# Altium schematic sheet IO Management.SchDoc
size C
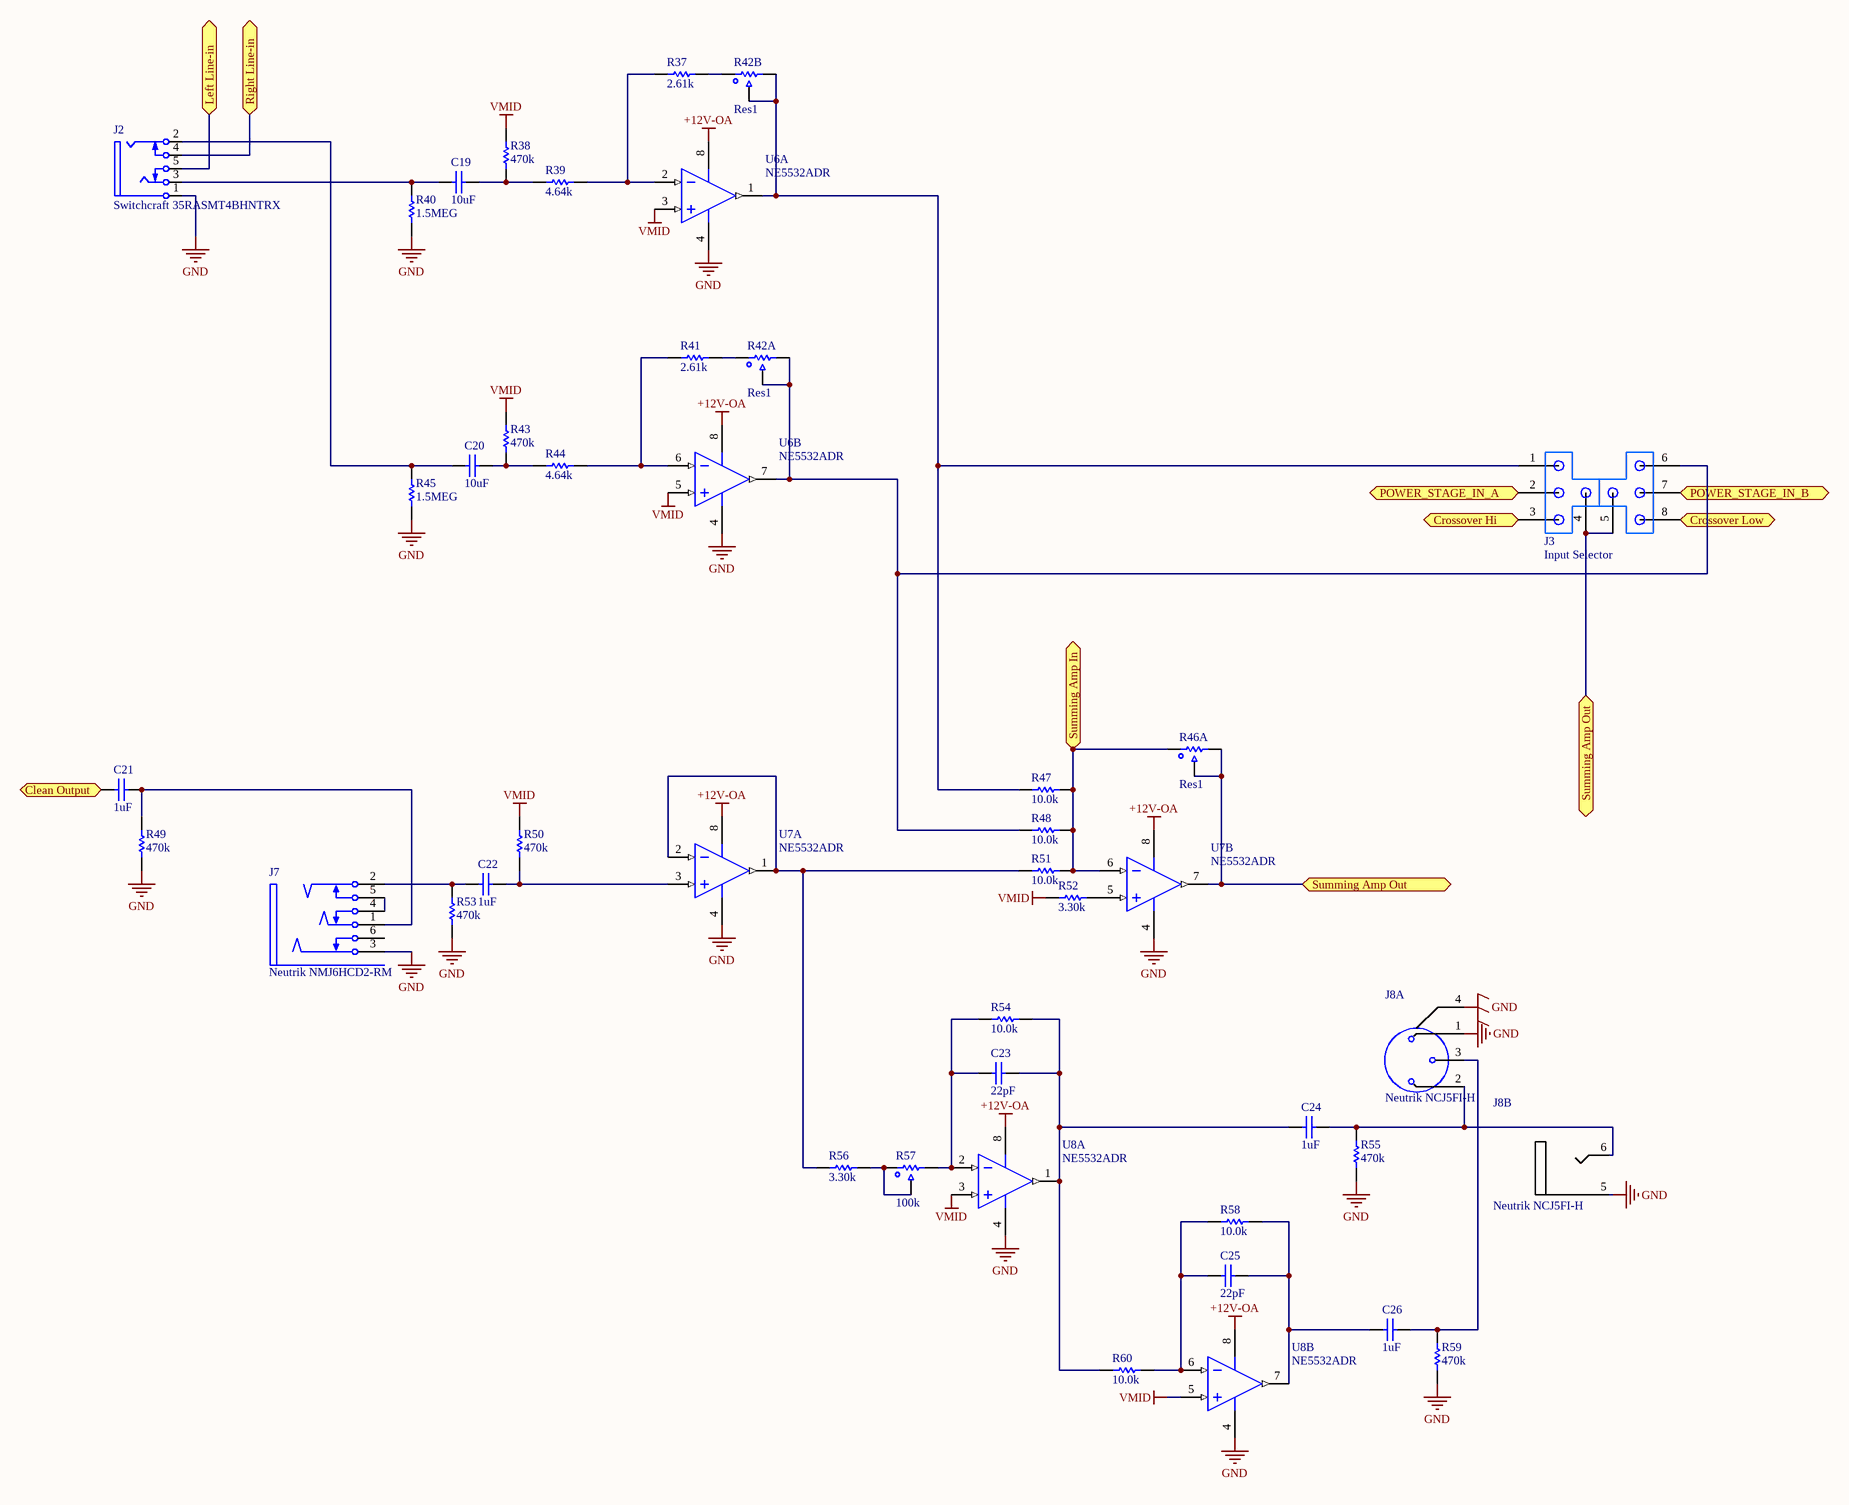
[diagram p0: IO Management.SchDoc]

## Parts
C19  10uF  [PCB-5c5sxu4lzqbcrp2k6kwf-1]
C20  10uF  [PCB-5c5sxu4lzqbcrp2k6kwf-1]
C21  1uF  [PCB-2wbb7ys4jm9z9dflo2i2-1]
C22  1uF  [PCB-2wbb7ys4jm9z9dflo2i2-1]
C23  22pF  [PCB-o7p1koxmr9wqz41gh50t-1]
C24  1uF  [PCB-2wbb7ys4jm9z9dflo2i2-1]
C25  22pF  [PCB-o7p1koxmr9wqz41gh50t-1]
C26  1uF  [PCB-2wbb7ys4jm9z9dflo2i2-1]
J2  Switchcraft 35RASMT4BHNTRX  [SWIT-35RASMT4BHNTRX_V]
J3  Input Selector  [PCB-r6lzv2511lj5epnn9hpr-1]
J7  Neutrik NMJ6HCD2-RM  [PCB-3345220-1]
J8  Neutrik NCJ5FI-H  [PCB-kqs2tegzu26oi3jl7i0a-1]  (parts A,B of 2)
R37  2.61k  [PCB-2fy4x9bysi6rpexrr8fu-1]
R38  470k  [RESC1609X55X28LL05T18]
R39  4.64k  [RESC1609X55X28LL05T18]
R40  1.5MEG  [RESC1608X55X30LL15T15]
R41  2.61k  [PCB-2fy4x9bysi6rpexrr8fu-1]
R42  Res1  [PCB-3c7eria7znpasna51pjn-1]  (parts A,B of 2)
R43  470k  [RESC1609X55X28LL05T18]
R44  4.64k  [RESC1609X55X28LL05T18]
R45  1.5MEG  [RESC1608X55X30LL15T15]
R46  Res1  [PCB-3c7eria7znpasna51pjn-1]  (part A of 2)
R47  10.0k  [RESC1609X55X28LL05T18]
R48  10.0k  [RESC1609X55X28LL05T18]
R49  470k  [RESC1609X55X28LL05T18]
R50  470k  [RESC1609X55X28LL05T18]
R51  10.0k  [RESC1609X55X28LL05T18]
R52  3.30k  [RESC1609X55X28LL05T18]
R53  470k  [RESC1609X55X28LL05T18]
R54  10.0k  [RESC1609X55X28LL05T18]
R55  470k  [RESC1609X55X28LL05T18]
R56  3.30k  [RESC1609X55X28LL05T18]
R57  100k  [PCB-3c7eria7znpasna51pjn-1]
R58  10.0k  [RESC1609X55X28LL05T18]
R59  470k  [RESC1609X55X28LL05T18]
R60  10.0k  [RESC1609X55X28LL05T18]
U6  NE5532ADR  [TI-D8_L]  (parts A,B of 2)
U7  NE5532ADR  [TI-D8_L]  (parts A,B of 2)
U8  NE5532ADR  [TI-D8_L]  (parts A,B of 2)

## Ports
Clean Output, Crossover Hi, Crossover Low, Left Line-in, POWER_STAGE_IN_A, POWER_STAGE_IN_B, Right Line-in, Summing Amp In, Summing Amp Out

## Nets
+12V-OA: U6.8(VCC+) U7.8(VCC+) U8.8(VCC+)
GND: J2.1 J7.3 J8.1 J8.4(G) J8.5(S) R40.1 R45.1 R49.1 R53.1 R55.1 R59.1 U6.4(VCC-) U7.4(VCC-) U8.4(VCC-)
VMID: R38.2 R43.2 R50.2 R52.1 U6.3(IN1+) U6.5(IN2+) U8.3(IN1+) U8.5(IN2+)
Clean Output: C21.1 ; port Clean Output
Crossover Hi: J3.3 ; port Crossover Hi
Crossover Low: J3.8 ; port Crossover Low
Left Line-in: J2.5 ; port Left Line-in
POWER_STAGE_IN_A: J3.2 ; port POWER_STAGE_IN_A
POWER_STAGE_IN_B: J3.7 ; port POWER_STAGE_IN_B
Right Line-in: J2.4 ; port Right Line-in
Summing Amp In: R46.R1_1 R47.2 R48.2 R51.2 U7.6(IN2-) ; port Summing Amp In
Summing Amp Out: J3.4 J3.5 R46.R1_2 R46.R1_3 U7.7(OUT2) ; port Summing Amp Out
NetC19_1: C19.1 J2.3 R40.2
NetC19_2: C19.2 R38.1 R39.1
NetC20_1: C20.1 J2.2 R45.2
NetC20_2: C20.2 R43.1 R44.1
NetC21_2: C21.2 J7.1 R49.2
NetC22_1: C22.1 J7.2 R53.2
NetC22_2: C22.2 R50.1 U7.3(IN1+)
NetC23_1: C23.1 R54.1 R57.3 U8.2(IN1-)
NetC23_2: C23.2 C24.1 R54.2 R60.1 U8.1(OUT1)
NetC24_2: C24.2 J8.2 J8.6(T) R55.2
NetC25_1: C25.1 R58.1 R60.2 U8.6(IN2-)
NetC25_2: C25.2 C26.1 R58.2 U8.7(OUT2)
NetC26_2: C26.2 J8.3 R59.2
NetJ3_1: J3.1 R42.R2_2 R42.R2_3 R47.1 U6.1(OUT1)
NetJ3_6: J3.6 R42.R1_2 R42.R1_3 R48.1 U6.7(OUT2)
NetJ7_4: J7.4 J7.5
NetR37_1: R37.1 R39.2 U6.2(IN1-)
NetR37_2: R37.2 R42.R2_1
NetR41_1: R41.1 R44.2 U6.6(IN2-)
NetR41_2: R41.2 R42.R1_1
NetR51_1: R51.1 R56.1 U7.1(OUT1) U7.2(IN1-)
NetR52_2: R52.2 U7.5(IN2+)
NetR56_2: R56.2 R57.1 R57.2

Not connected (* = marked no-connect by the designer): J7 6

## Library data of the parts
C19 C20 = CMP-f13b3967d5202efc-1: Cap Film 10uF 63V PET 5% (26.5 X 8.5 X 17mm) Radial Wound 22.5mm 105C Automotive Bulk; Manufacturer Part Number: 60DN51005030J; Manufacturer: Kemet; RoHS: Compliant; Capacitance: 10uF; OctopartID: f13b3967d5202efc
C21 C22 C24 C26 = CMP-85fe4cf7e9a75a39-2: B32529 Series 63 V 1 uF Radial LS=5 mm Stacked Metallized PET Film Capacitor; Manufacturer Part Number: B32529C105J289; Manufacturer: TDK; Capacitance: 1uF
C23 C25 = CMP-5839914dedd787fe-1: CL10 Series 22 pF 50V ±5 % Tolerance C0G SMT Multilayer Ceramic Capacitor; Manufacturer: Samsung; Manufacturer Part Number: CL10C220JB8NNNC; Dielectric Characteristic: C0G/NP0; Octopart URL: http://octopart.com/cl10c220jb8nnnc-samsung-8294536; Mounting Style: Surface Mount
J2 = CMP-329442-8: Female 3.5 mm Phone Jack, 5 Position, Height 5 mm, RoHS, Tape and Reel; Lead-Free Status: Lead Free; RoHS: Compliant; PackageDescription: Female 3.5 mm Phone Jack, 5 Position, Height 5 mm; OctopartID: 05ecccef17f4da2b; Seller Landing  Url: https://octopart-clicks.com/click/track?country=US&ak=8157f166&sig=00fbda3&sid=459&ppid=604030&vpid=40873333&ct=offers; Octopart Url: http://octopart.com/35rasmt4bhntrx-switchcraft-604030; PackageReference: 35RASMT4BHNTRX; Manufacturer Part Number: 35RASMT4BHNTRX; DatasheetVersion: Rev. C, 07/2014
J3 = CMP-fydh8mqcn19uwpn0klog-2: 3 way stereo H-shaped pin header jumper 2.54mm
J7 = CMP-3345220-6: Phone Connectors 1/4" STERO JCK SWTCH FULL TRD NSE PC HORZ; OctopartID: de6b171403b801ac; Manufacturer: Neutrik; Manufacturer Part Number: NMJ6HCD2-RM; Octopart Url: https://octopart.com/nmj6hcd2-rm-neutrik-7731381
J8 = CMP-d6ad1fac6a3f096a-1: Neutrik NCJ5FI-H Combo 3-Pin XLRF / 1/4 Inch Mono Horizontal PCB Mount; Gender: Female; Voltage Rating (DC): 50.0 V; Number of Positions: 5; Octopart URL: http://octopart.com/ncj5fi-h-neutrik-760308; OctopartID: d6ad1fac6a3f096a; Contact Plating: Gold; Mounting Style: Solder, PCB; RoHS: Compliant; Manufacturer Part Number: NCJ5FI-H; Manufacturer: Neutrik
R37 R41 = CMP-9c6957e4a20743ae-1: Res Thin Film 0603 2.61K Ohm 0.1% 1/10W ±25ppm/°C Molded SMD Paper T/R; Manufacturer: Vishay; Manufacturer Part Number: MCT06030D2611BP100; Resistance: 2.61 kΩ; Power Rating: 100 mW; Size-Length: 1.55 mm; Resistance Tolerance: ±0.1%; Packaging: Tape & Reel (TR)
R38 R43 R49 R50 R53 R55 R59 = CMP-f7e03fd772d42827-1: Res Thin Film 0603 470K Ohm 0.1% 1/10W ±25ppm/°C Molded SMD SMD Paper T/R; Manufacturer Part Number: MCT06030D4703BP100; Lead-Free Status: Lead Free
R39 R44 = CMP-ae07668bb89171c0-1: Res Thin Film 0603 4.64K Ohm 0.1% 1/10W ±25ppm/°C Molded SMD SMD Paper T/R; Manufacturer Part Number: MCT06030D4641BP100; Power Rating: 100 mW; Lead-Free Status: Lead Free; Size-Width: 850 µm; Size-Length: 1.55 mm; Packaging: Tape & Reel (TR); Case/Package: 0603; Mounting Style: Surface Mount; Octopart URL: http://octopart.com/mct06030d4641bp100-vishay+semiconductor-25572336; Resistance Tolerance: ±0.1%; OctopartID: ae07668bb89171c0; RoHS: Compliant
R40 R45 = CMP-3681775-2: Thick Film Resistors - SMD 0603 1.5Mohms 1% Tol; Manufacturer Part Number: ERJ-3EKF1504V; Manufacturer: Panasonic; Lead-Free Status: Lead Free; Power Rating: 0.1 W; Resistance: 1500000.0 Ω; Voltage Rating (DC): 75.0 V; Case/Package: 0603; Lifecycle Status: Not Listed by Manufacturer; Mounting Style: Surface Mount; Octopart Url: https://octopart.com/erj-3ekf1504v-panasonic-55421490; OctopartID: f919335e764d26de; Packaging: Cut Tape (CT); Resistance Tolerance: ±1%; RoHS: Compliant; Size-Height: 0.00045 m; Size-Length: 0.0016 m; Size-Width: 0.0008 m
R42 R46 = CMP-f1923a8ba4e42e55-1: Panel Control - 9mm-St-Carbon; Packaging: Tray
R47 R48 R51 R54 R58 R60 = CMP-893e42b9f3a056f9-1: Precision Thin Film Smnt Resistor 0603 Case 10kOhm +/-0.1% 0.1W +/-25ppm/degC; Manufacturer: Vishay; Manufacturer Part Number: MCT06030D1002BP100; Lead-Free Status: Lead Free; Resistance Tolerance: ±0.1%; Voltage Rating (DC): 50.0 V; Resistance: 10.0 kΩ; Power Rating: 100 mW; Packaging: Tape & Reel (TR); RoHS: Compliant; Mounting Style: Surface Mount; Size-Length: 1.55 mm; Size-Width: 850 µm; Octopart URL: http://octopart.com/mct06030d1002bp100-vishay-42819576; Case/Package: 0603; Size-Height: 450 µm
R52 R56 = CMP-182ad3b0fdf8c7ed-1: Precision Thin Film Smnt Resistor 0603 Case 3.3kOhm +/-0.1% 0.1W +/-25ppm/C; Manufacturer: Vishay; Manufacturer Part Number: MCT06030D3301BP100; Resistance: 3.30 kΩ; Resistance Tolerance: ±0.1%; Octopart URL: http://octopart.com/mct06030d3301bp100-vishay-43040948; RoHS: Compliant; Size-Height: 450 µm; OctopartID: 182ad3b0fdf8c7ed; Case/Package: 0603; Mounting Style: Surface Mount; Size-Width: 850 µm
R57 = CMP-015dc8c8d918de9a-1: Pot 100k Ohm 1/20w Carbon Linear; Manufacturer Part Number: PTD901-2015F-B104; Mounting Style: PCB, Board, Panel; OctopartID: 015dc8c8d918de9a; Packaging: Tray
U6-U8 = CMP-13597030-2: Dual Low-Noise Operational Amplifier, 10 to 30 V, 0 to 70 degC, 8-pin SOIC (D8), Green (RoHS & no Sb/Br); Bandwidth: 10000000.0 Hz; Lead-Free Status: Lead Free; Number of Channels: 2; Slew Rate: 9.0 V/μs; Supply Voltage (DC): 30.0 V; Gain Bandwidth Product: 10000000.0 Hz; Lifecycle Status: Active; Mounting Style: Surface Mount; Number of Circuits: 2; Number of Pins: 8; Octopart Url: https://octopart.com/ne5532adr-texas+instruments-409175; OctopartID: 270fee033c3ef8c8; Packaging: Tape & Reel (TR); REACH SVHC Compliance: No SVHC; RoHS: Compliant